# EAGLE schematic eins (EAGLE 7.6.0)
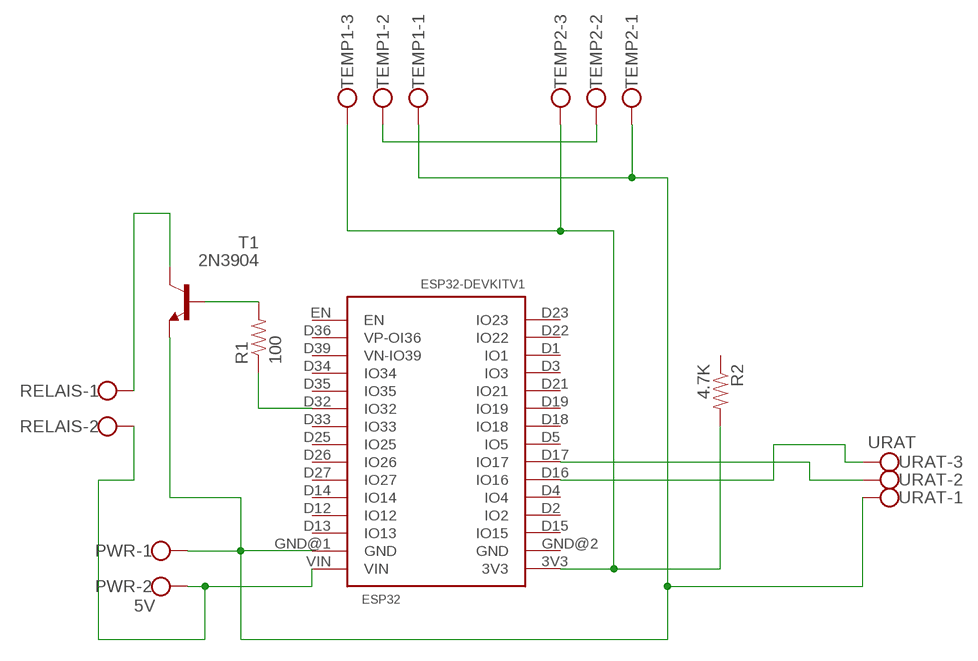
[diagram p0: schematic, sheet 1]

## Parts
ESP32  ESP32DEVKITV1  [ESP32-DEVKITV1]
PWR  5V  W237-102  [W237-102]
R1  100  RESISTORPTH-1/4W  [AXIAL-0.4]
R2  4.7K  RESISTORPTH-1/4W  [AXIAL-0.4]
RELAIS  W237-102  [W237-102]
T1  2N3904  [TO92]
TEMP1  W237-103  [W237-103]
TEMP2  W237-103  [W237-103]
URAT  URAT  W237-103  [W237-103]

## Nets
GND: ESP32.GND@1(GND) PWR.1 T1.3(E) TEMP1.1 TEMP2.1 URAT.1
N$1: ESP32.D17(IO17) URAT.2
N$2: ESP32.VIN PWR.2 RELAIS.2
N$3: R1.P$2 T1.2(B)
N$4: RELAIS.1 T1.1(C)
N$5: ESP32.D32(IO32) R1.P$1
N$7: ESP32.3V3 R2.P$2 TEMP1.3 TEMP2.3
N$8: TEMP1.2 TEMP2.2
N$9: ESP32.D16(IO16) URAT.3
Unconnected: ESP32.D1(IO1) ESP32.D2(IO2) ESP32.D3(IO3) ESP32.D4(IO4) ESP32.D5(IO5) ESP32.D12(IO12) ESP32.D13(IO13) ESP32.D14(IO14) ESP32.D15(IO15) ESP32.D18(IO18) ESP32.D19(IO19) ESP32.D21(IO21) ESP32.D22(IO22) ESP32.D23(IO23) ESP32.D25(IO25) ESP32.D26(IO26) ESP32.D27(IO27) ESP32.D33(IO33) ESP32.D34(IO34) ESP32.D35(IO35) ESP32.D36(VP-OI36) ESP32.D39(VN-IO39) ESP32.EN ESP32.GND@2(GND) R2.P$1

## Library data of the parts
ESP32 = ESP32-DEVKITV1:ESP32DEVKITV1
PWR RELAIS = con-wago-500:W237-102: WAGO SCREW CLAMP; MPN: 237-102; OC_FARNELL: unknown; OC_NEWARK: 70K9898
R1 R2 = SparkFun-Passives:RESISTOR: Resistor Basic schematic elements and footprints for 0603, 1206, and PTH resistors.
T1 = transistor:2N3904: NPN TRANSISTOR
TEMP1 TEMP2 URAT = con-wago-500:W237-103: WAGO SCREW CLAMP; MPN: 237-103; OC_FARNELL: unknown; OC_NEWARK: 18M7116